# EAGLE design Moduł zasilania 12V (EAGLE 8.7.0)
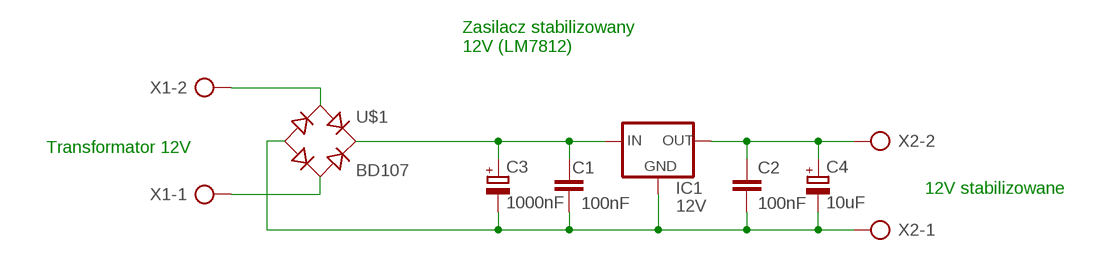
[diagram p0: schematic, sheet 1]

## Parts
C1  100nF  C-EU050-045-075  [C50-45-75]
C2  100nF  C-EU050-045-075  [C50-45-75]
C3  1000nF  C-EU-POL  [E5-13]
C4  10uF  C-EU-POL'  [E2,5-6]
IC1  12V  78XXS  [78XXS]
U$1  BD107  [B-DIL]
X1  AK300/2  [AK300/2]
X2  AK300/2  [AK300/2]

## Nets
N$1: U$1.AC1 X1.2
N$2: U$1.AC2 X1.1
N$3: C1.P$1 C2.P$2 C3.P$2(-) C4.P$2(-) IC1.GND U$1.- X2.1
N$4: C1.P$2 C3.P$1(+) IC1.IN U$1.+
N$5: C2.P$1 C4.P$1(+) IC1.OUT X2.2

## Notes on the sheet
- Zasilacz stabilizowany 
  12V (LM7812)
- Transformator 12V
- 12V stabilizowane

## Library data of the parts
C1 C2 = RCL!:C-EU
C3 C4 = RCL!:C-EU-POL
IC1 = v-reg:78XXS: VOLTAGE REGULATOR
U$1 = Diody, mostki:BD107
X1 X2 = con-ptr500:AK300/2: CONNECTOR; OC_FARNELL: unknown; OC_NEWARK: unknown

## Board
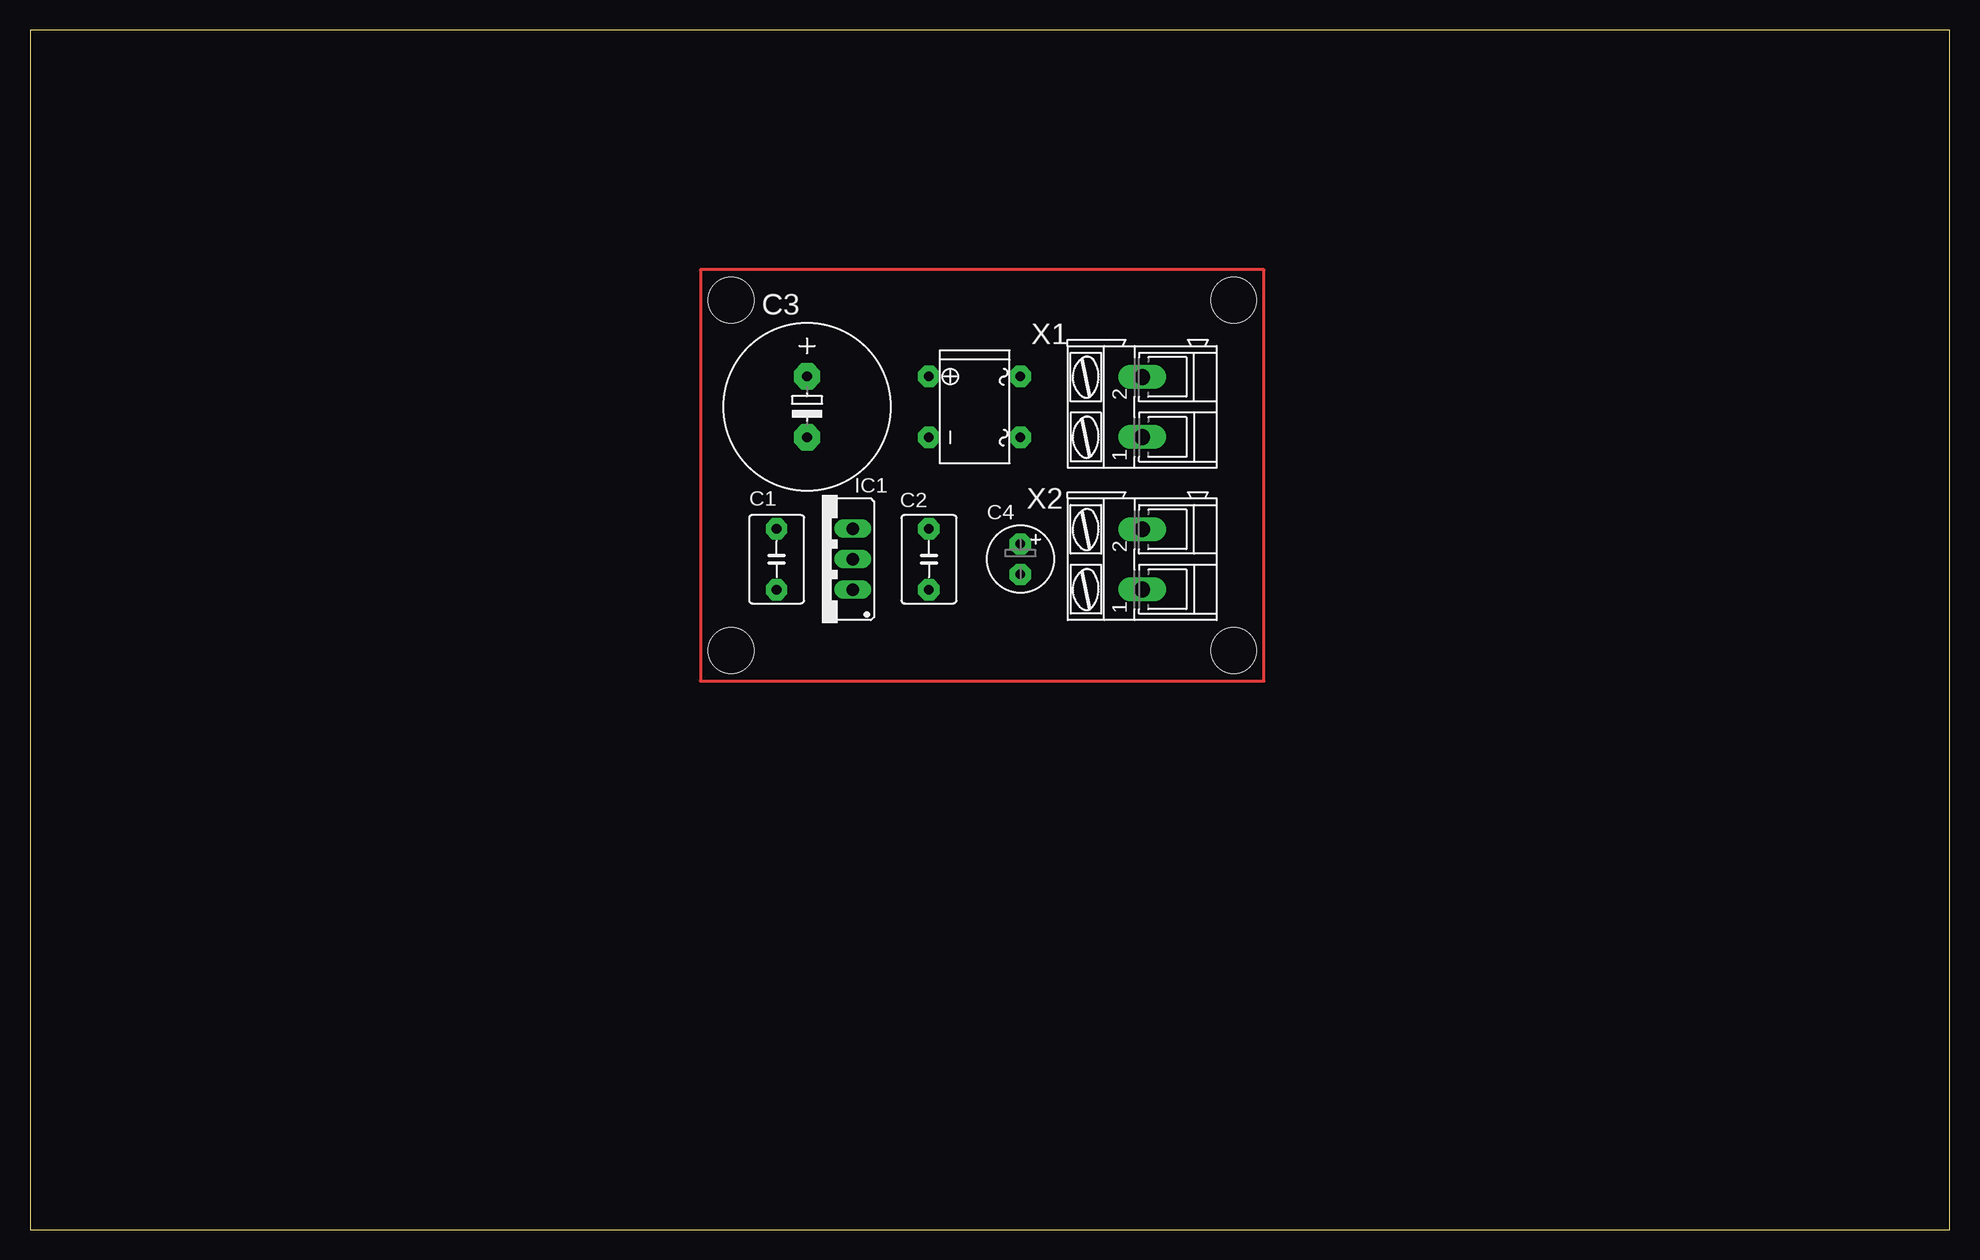
[diagram p1: board, top side]
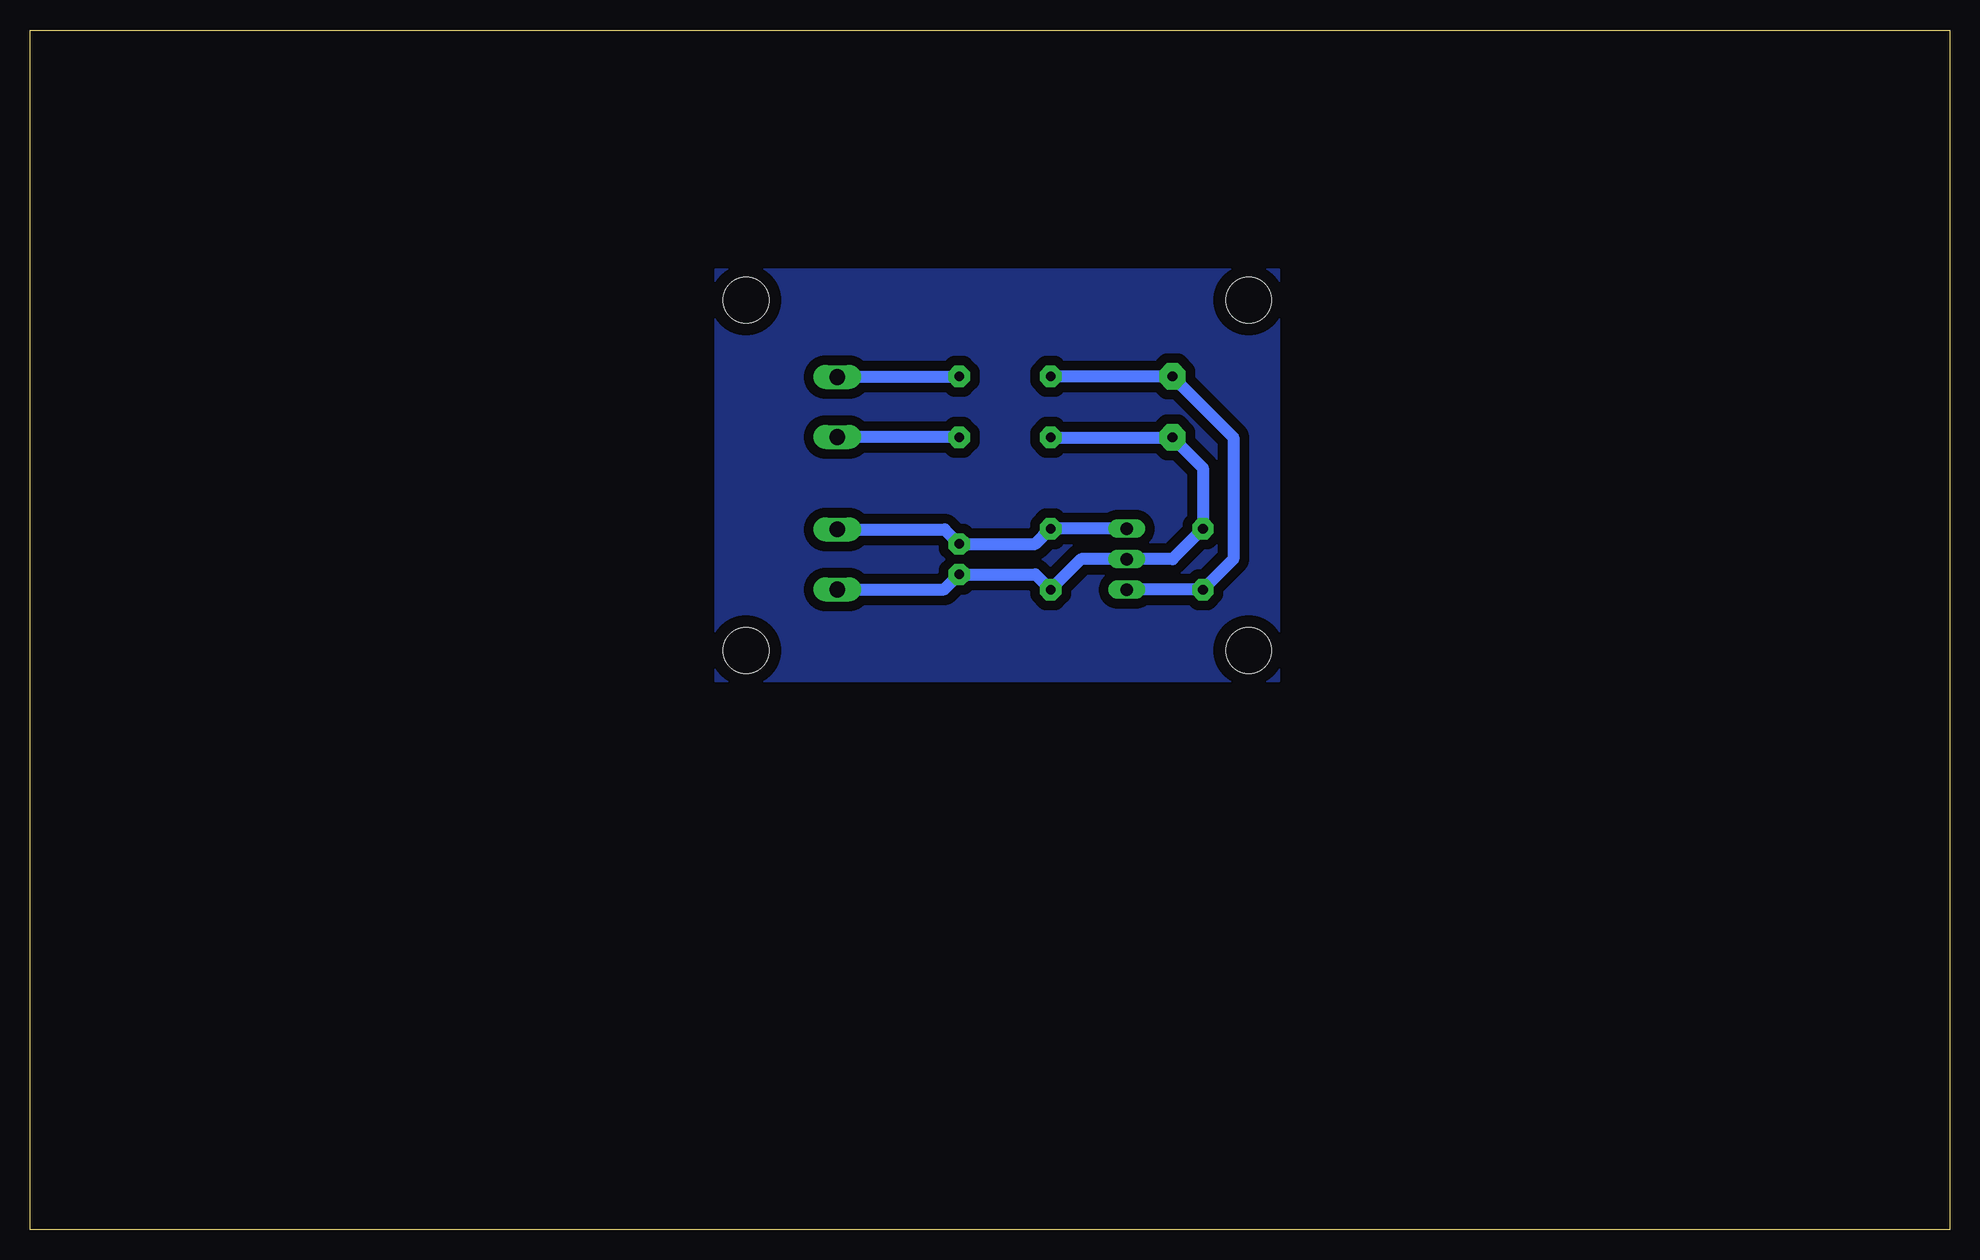
[diagram p2: board, bottom side, seen from below]

Size 160 x 100 mm. Coordinates in mm from the lower left corner, seen from the top.
Outline: 0,0 160,0 160,100 0,100 0,0
Copper layers (1*16): Top 0.035mm / dielectric 1.5mm / Bottom 0.035mm
Design rules "default": minimum track width 6mil, minimum drill 0.35mm, track to track 6mil, track to pad 6mil, pad to pad 6mil, via to via 6mil, smd to smd 6mil, copper to edge 40mil, drill to drill 6mil, minimum pad ring 10mil, minimum via ring 8mil, stop-mask expansion 4mil, vias tented up to drill 0mil, thermal gap 10mil
Holes 3.81 mm at 58.42,77.47 100.33,77.47 100.33,48.26 58.42,48.26

### Footprints (pad centres in the part's own frame; a part is rotated, then mirrored left to right if it is on the bottom)
C50-45-75 = drill 0.8 pad 1.778 octagon: P$1 -2.54,0; P$2 2.54,0
E5-13 = drill 0.8 pad 2.184 octagon: P$1 -2.54,0; P$2 2.54,0
E2,5-6 = drill 0.8 pad 1.778 octagon: P$1 -1.27,0; P$2 1.27,0
78XXS = drill 1.016 long: GND 0,-2.54; IN -2.54,-2.54; OUT 2.54,-2.54
B-DIL = drill 0.8 pad 1.778 octagon: + -2.54,-3.81; - 2.54,-3.81; AC1 -2.54,3.81; AC2 2.54,3.81
AK300/2 = drill 1.321 long: 1 -2.515,0; 2 2.489,0

### Placement (x,y rotation side)
C1  62.23,55.88 270 top
C2  74.93,55.88 270 top
C3  64.77,68.58 270 top
C4  82.55,55.88 270 top
IC1  66.04,55.88 90 top
U$1  78.74,68.58 270 top
X1  92.71,68.58 90 top
X2  92.71,55.88 90 top

### Tracks (layer width: path | path; a pad name or v marks a point on that pad's centre or on a via)
N$1
  Bottom 1.016: X1.2 92.66,71.12 U$1.AC1
N$2
  Bottom 1.016: U$1.AC2 82.58,66.06 X1.1
N$3
  Bottom 1.016: U$1.- C3.P$2 62.23,63.5 C1.P$1 64.77,55.88 IC1.GND 72.39,55.88 C2.P$2 76.2,54.61 C4.P$2 83.8,53.37 X2.1
N$4
  Bottom 1.016: U$1.+ C3.P$1 59.69,66.04 59.69,55.88 C1.P$2 IC1.IN
N$5
  Bottom 1.016: IC1.OUT C2.P$1 76.2,57.15 C4.P$1 83.77,58.37 X2.2
N$6
  Top 0.254: 55.88,80.01 55.88,45.72 102.87,45.72 102.87,80.01 55.88,80.01
N$7
  pour Bottom (isolate 0.813): 55.88,80.01 55.88,45.72 102.87,45.72 102.87,80.01